# EAGLE schematic RF-STM32 v62 (EAGLE 9.7.0)
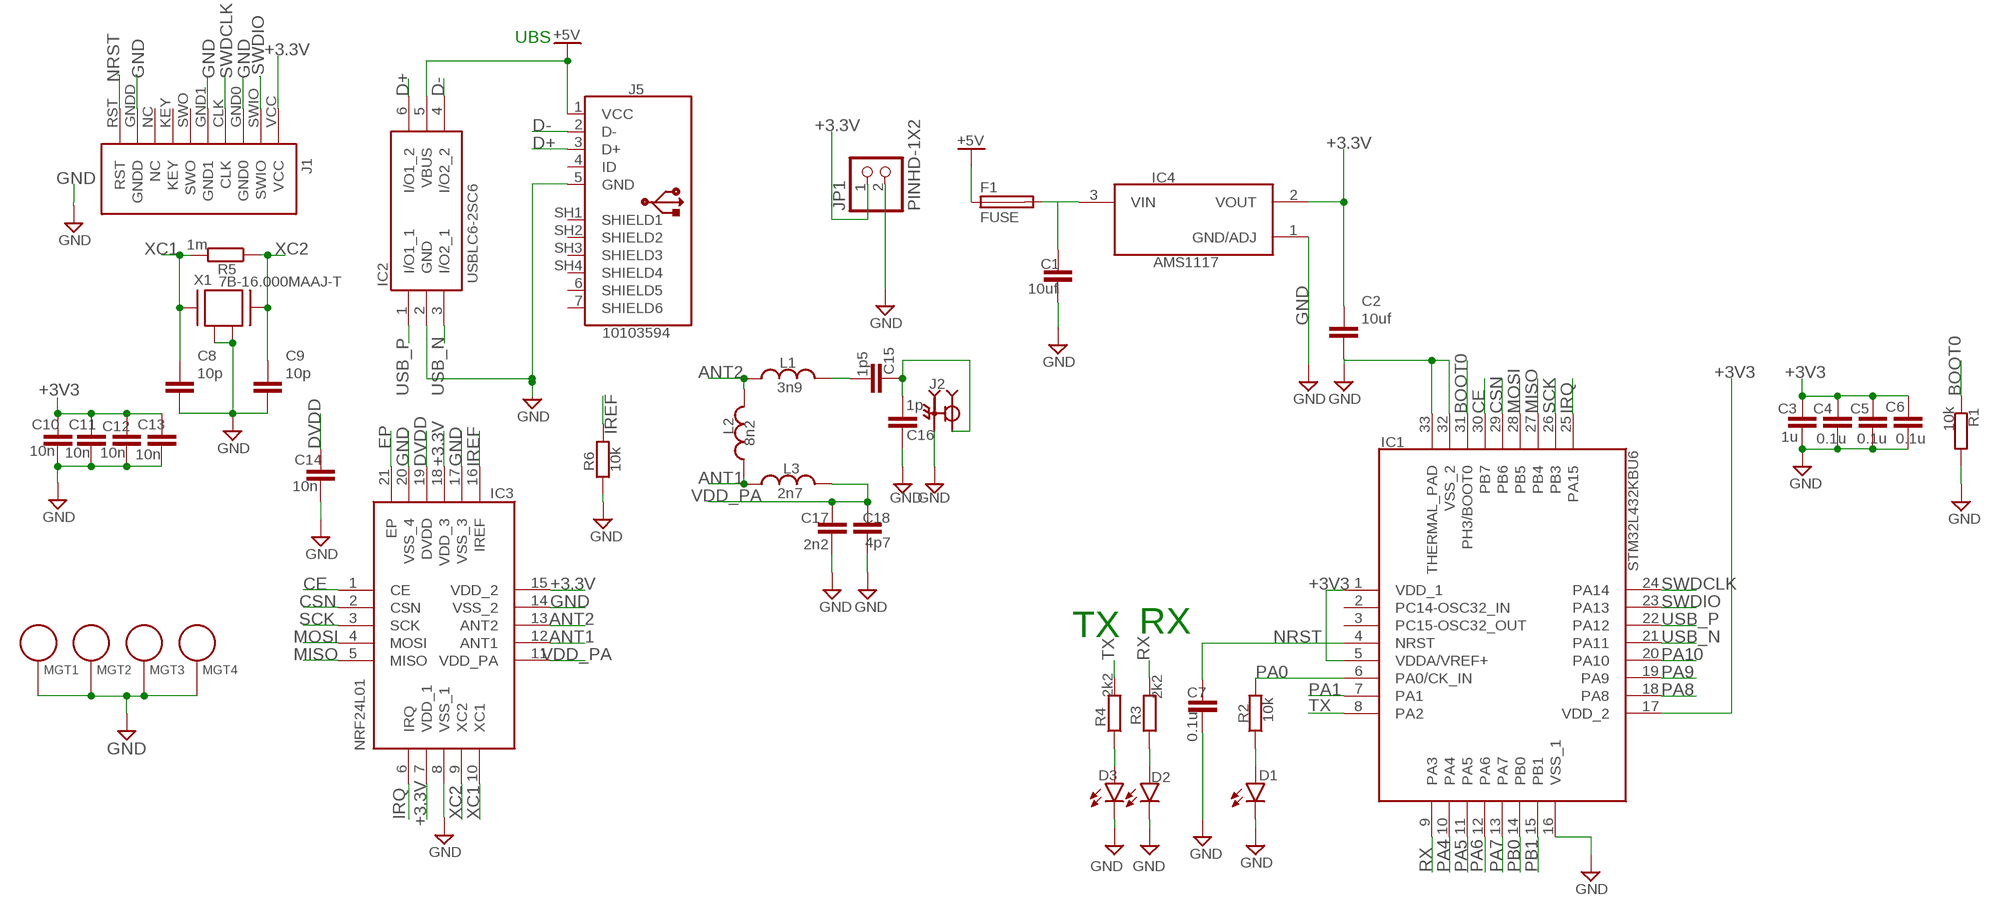
[diagram p0: schematic, sheet 1]

## Parts
C1  10uf  C_CHIP-0603(1608-METRIC)  [CAPC1608X85]
C2  10uf  C_CHIP-0603(1608-METRIC)  [CAPC1608X85]
C3  1u  C_CHIP-0603(1608-METRIC)  [CAPC1608X85]
C4  0.1u  C_CHIP-0603(1608-METRIC)  [CAPC1608X85]
C5  0.1u  C_CHIP-0603(1608-METRIC)  [CAPC1608X85]
C6  0.1u  C_CHIP-0603(1608-METRIC)  [CAPC1608X85]
C7  0.1u  C_CHIP-0603(1608-METRIC)  [CAPC1608X85]
C8  10p  C_CHIP-0603(1608-METRIC)  [CAPC1608X85]
C9  10p  C_CHIP-0603(1608-METRIC)  [CAPC1608X85]
C10  10n  C_CHIP-0603(1608-METRIC)  [CAPC1608X85]
C11  10n  C_CHIP-0603(1608-METRIC)  [CAPC1608X85]
C12  10n  C_CHIP-0603(1608-METRIC)  [CAPC1608X85]
C13  10n  C_CHIP-0603(1608-METRIC)  [CAPC1608X85]
C14  10n  C_CHIP-0603(1608-METRIC)  [CAPC1608X85]
C15  1p5  C_CHIP-0603(1608-METRIC)  [CAPC1608X85]
C16  1p  C_CHIP-0603(1608-METRIC)  [CAPC1608X85]
C17  2n2  C_CHIP-0603(1608-METRIC)  [CAPC1608X85]
C18  4p7  C_CHIP-0603(1608-METRIC)  [CAPC1608X85]
D1  CHIP-ROUND-R_0603-1MM  [LEDC1608X95N_RND-R]
D2  CHIP-ROUND-R_0603-1MM  [LEDC1608X95N_RND-R]
D3  CHIP-ROUND-R_0603-1MM  [LEDC1608X95N_RND-R]
F1  FUSE  FUSE_CHIP-0603(1608-METRIC)  [FUSC1608X60N]
IC1  STM32L432KBU6  [QFN50P500X500X60-33N]
IC2  USBLC6-2SC6  [SOT95P280X145-6N]
IC3  NRF24L01  [QFN50P400X400X95-21N]
IC4  AMS1117  [SOT229P700X180-4N]
J1  826953-5  [TE_826953-5]
J2  SMA-J-P-H-ST-EM1  [SAMTEC_SMA-J-P-H-ST-EM1]
J5  10103594  [10103594]
JP1  PINHD-1X2  [1X02]
L1  3n9  L_CHIP-0603(1608-METRIC)  [INDC1608X95N]
L2  8n2  L_CHIP-0603(1608-METRIC)  [INDC1608X95N]
L3  2n7  L_CHIP-0603(1608-METRIC)  [INDC1608X95N]
MGT1  MOUNTING_HOLE  [BEAGLEBONEBLACK_MOUNTING_HOLE]
MGT2  MOUNTING_HOLE  [BEAGLEBONEBLACK_MOUNTING_HOLE]
MGT3  MOUNTING_HOLE  [BEAGLEBONEBLACK_MOUNTING_HOLE]
MGT4  MOUNTING_HOLE  [BEAGLEBONEBLACK_MOUNTING_HOLE]
R1  10k  R_CHIP-0603(1608-METRIC)  [RESC1608X60]
R2  10k  R_CHIP-0603(1608-METRIC)  [RESC1608X60]
R3  2k2  R_CHIP-0603(1608-METRIC)  [RESC1608X60]
R4  2k2  R_CHIP-0603(1608-METRIC)  [RESC1608X60]
R5  1m  R_CHIP-0603(1608-METRIC)  [RESC1608X60]
R6  10k  R_CHIP-0603(1608-METRIC)  [RESC1608X60]
X1  7B-16.000MAAJ-T  [7B-16.000MAAJ-T]

## Nets
+3.3V: C2.1 IC3.7(VDD_1) IC3.15(VDD_2) IC3.18(VDD_3) IC4.2(VOUT) J1.VCC JP1.1
+3V3: C3.1 C4.1 C5.1 C6.1 C10.1 C11.1 C12.1 C13.1 IC1.1(VDD_1) IC1.5(VDDA/VREF+) IC1.17(VDD_2)
+5V: F1.1 IC2.5(VBUS) J5.1(VCC)
ANT1: IC3.12(ANT1) L2.1 L3.1
ANT2: IC3.13(ANT2) L1.1 L2.2
BOOT0: IC1.31(PH3/BOOT0) R1.2
CE: IC1.30(PB7) IC3.1(CE)
CSN: IC1.29(PB6) IC3.2(CSN)
D+: IC2.6(I/O1_2) J5.3(D+)
D-: IC2.4(I/O2_2) J5.2(D-)
DVDD: C14.1 IC3.19(DVDD)
EP: IC3.21(EP)
GND: C1.2 C2.2 C3.2 C4.2 C5.2 C6.2 C7.2 C8.2 C9.2 C10.2 C11.2 C12.2 C13.2 C14.2 C16.2 C17.1 C18.1 D1.C D2.C D3.C IC1.16(VSS_1) IC1.32(VSS_2) IC1.33(THERMAL_PAD) IC2.2(GND) IC3.8(VSS_1) IC3.14(VSS_2) IC3.17(VSS_3) IC3.20(VSS_4) IC4.1(GND/ADJ) J1.GND0 J1.GND1 J1.GNDD J2.2_1 J2.2_2 J2.3_1 J2.3_2 J5.5(GND) JP1.2 MGT1.P$1 MGT2.P$1 MGT3.P$1 MGT4.P$1 R1.1 R6.1 X1.2 X1.4
IREF: IC3.16(IREF) R6.2
IRQ: IC1.25(PA15) IC3.6(IRQ)
MISO: IC1.27(PB4) IC3.5(MISO)
MOSI: IC1.28(PB5) IC3.4(MOSI)
N$1: C1.1 F1.2 IC4.3(VIN)
N$3: D1.A R2.1
N$8: C15.1 L1.2
N$9: C15.2 C16.1 J2.1
N$11: D2.A R3.1
N$12: D3.A R4.1
NRST: C7.1 IC1.4(NRST) J1.RST
PA0: IC1.6(PA0/CK_IN) R2.2
PA1: IC1.7(PA1)
PA4: IC1.10(PA4)
PA5: IC1.11(PA5)
PA6: IC1.12(PA6)
PA7: IC1.13(PA7)
PA8: IC1.18(PA8)
PA9: IC1.19(PA9)
PA10: IC1.20(PA10)
PB0: IC1.14(PB0)
PB1: IC1.15(PB1)
RX: IC1.9(PA3) R3.2
SCK: IC1.26(PB3) IC3.3(SCK)
SWDCLK: IC1.24(PA14) J1.CLK
SWDIO: IC1.23(PA13) J1.SWIO
TX: IC1.8(PA2) R4.2
USB_N: IC1.21(PA11) IC2.3(I/O2_1)
USB_P: IC1.22(PA12) IC2.1(I/O1_1)
VDD_PA: C17.2 C18.2 IC3.11(VDD_PA) L3.2
XC1: C8.1 IC3.10(XC1) R5.2 X1.1
XC2: C9.1 IC3.9(XC2) R5.1 X1.3
Unconnected: IC1.2(PC14-OSC32_IN) IC1.3(PC15-OSC32_OUT) J1.KEY J1.NC J1.SWO J5.4(ID) J5.6(SHIELD5) J5.7(SHIELD6) J5.SH1(SHIELD1) J5.SH2(SHIELD2) J5.SH3(SHIELD3) J5.SH4(SHIELD4)

## Notes on the sheet
- UBS
- TX | RX

## Library data of the parts
C1-C18 = Capacitor:C: Capacitor - Generic; CATEGORY: Capacitor
D1-D3 = LED:CHIP-ROUND-R: LED - Generic; CATEGORY: LED; COLOR: RED; DESCRIPTION: CHIP LED ROUND; SUB-CATEGORY: CHIP; TYPE: ROUND_TOP
F1 = Circuit-Protection:FUSE: Fuse - Generic; CATEGORY: Circuit-Protection; SUB-CATEGORY: Fuse
IC1 = STM32L432KBU6/UFQFPN:STM32L432KBU6: ARM Microcontrollers - MCU Ultra-low-power with FPU ARM Cortex-M4 MCU 80 MHz with 256 Kbytes Flash, USB Source: Datasheet <http://www.st.com/content/ccc/resource/technical/document/datasheet/24/01/9f/59/f0/83/47/fc/DM00257205.pdf/files/DM00257205.pdf/jcr:content/translations/en.DM00257205.pdf>; ARROW_PART_NUMBER: STM32L432KBU6; ARROW_PRICE-STOCK: https://www.arrow.com/en/products/stm32l432kbu6/stmicroelectronics; DESCRIPTION: ARM Microcontrollers - MCU Ultra-low-power with FPU ARM Cortex-M4 MCU 80 MHz with 256 Kbytes Flash, USB; HEIGHT: 0.6mm; MANUFACTURER_NAME: STMicroelectronics; MANUFACTURER_PART_NUMBER: STM32L432KBU6; MOUSER_PART_NUMBER: 511-STM32L432KBU6; MOUSER_PRICE-STOCK: https://www.mouser.co.uk/ProductDetail/STMicroelectronics/STM32L432KBU6/?qs=qzCNEk%252BRr%252BbQvfxQ4ZNP4A%3D%3D
IC2 = USBLC6-2SC6:USBLC6-2SC6: TVS Diode Array Uni-Directional USBLC6-2SC6 17V, SOT-23 6-Pin Source: Datasheet <http://www.st.com/st-web-ui/static/active/en/resource/technical/document/datasheet/CD00050750.pdf>; ARROW_PART_NUMBER: USBLC6-2SC6; ARROW_PRICE-STOCK: https://www.arrow.com/en/products/usblc6-2sc6/stmicroelectronics; DESCRIPTION: TVS Diode Array Uni-Directional USBLC6-2SC6 17V, SOT-23 6-Pin; HEIGHT: 1.45mm; MANUFACTURER_NAME: STMicroelectronics; MANUFACTURER_PART_NUMBER: USBLC6-2SC6; MOUSER_PART_NUMBER: 511-USBLC6-2SC6; MOUSER_PRICE-STOCK: https://www.mouser.co.uk/ProductDetail/STMicroelectronics/USBLC6-2SC6?qs=po45yt2pPpu%2FhNIlwQdTlg%3D%3D
IC3 = NRF24L01-QFN-20pin:NRF24L01: RF Transceiver 1.9-3.6V 2.4GHz XCVR ENHNCD SHCKBRST Source: Datasheet <https://www.nordicsemi.com/chi/content/download/2730/34105/file/nRF24L01_Product_Specification_v2_0.pdf>; ARROW_PART_NUMBER: NRF24L01; ARROW_PRICE-STOCK: https://www.arrow.com/en/products/nrf24l01/nordic-semiconductor; DESCRIPTION: RF Transceiver 1.9-3.6V 2.4GHz XCVR ENHNCD SHCKBRST; HEIGHT: 0.95mm; MANUFACTURER_NAME: Nordic Semiconductor; MANUFACTURER_PART_NUMBER: NRF24L01; MOUSER_PART_NUMBER: 949-NRF24L01; MOUSER_PRICE-STOCK: https://www.mouser.co.uk/ProductDetail/Nordic-Semiconductor/nRF24L01?qs=yd0qOhnSiDdtPhpOyQGKeQ%3D%3D
IC4 = AMS1117:AMS1117: 1117 Source: Datasheet <https://datasheet.lcsc.com/szlcsc/Advanced-Monolithic-Systems-AMS-AMS1117-ADJ_C6188.pdf>; DESCRIPTION: 1117; HEIGHT: 1.8mm; MANUFACTURER_NAME: Advanced Monolithic Systems; MANUFACTURER_PART_NUMBER: AMS1117
J1 = Header-right-25pin-2.54mm:826953-5; COMMENT: 826953-5; EU_ROHS_COMPLIANCE: Compliant
J2 = SMA-J-P-H-ST-EM1:SMA-J-P-H-ST-EM1: SMA Connector Jack, Female Socket 50Ohm Board Edge, End Launch Solder; MANUFACTURER: Samtec; MAXIMUM_PACKAGE_HEIGHT: 3.675mm; PARTREV: G; STANDARD: Manufacturer Recommendations
J5 = Connector_USB:10103594: USB(2.0) Micro-B, RCPT, 5POS, SMD-THT-R/A Datasheet <https://cdn.amphenol-icc.com/media/wysiwyg/files/documentation/datasheet/inputoutput/io_usb_micro.pdf> Drawing <https://cdn.amphenol-icc.com/media/wysiwyg/files/drawing/10103594.pdf>; CATEGORY: Connectors; CONTACTS: 5; CURRENT-RATING: 1.8A; DESCRIPTION: CONN RCPT USB2.0 MICRO B SMD R/A; GENDER: Receptacle; MANUFACTURER: Amphenol ICC (FCI); MOUNT_TYPE: R/A; MPN: 10103594-0001LF; OPERATING_TEMPERATURE: -30°C ~ 80°C; PART_STATUS: ACTIVE; ROHS_COMPLIANT: COMPLIANT; SUB_CATEGORY: USB; TYPE: USB-micro B; VOLTAGE-RATING: 100VAC
JP1 = Connector:PINHD-1X2: PIN HEADER; CATEGORY: CONNECTOR; SUB-CATEGORY: PIN-HEADER
L1-L3 = Inductor:L: Inductor Fixed - Generic; CATEGORY: Inductor; SUB-CATEGORY: Fixed
MGT1-MGT4 = BeagleBone_Blue_R3:MOUNTING_HOLE: Chassis Mounting Hole w/GND connection ability
R1-R6 = Resistor:R: Resistor Fixed - Generic; CATEGORY: Resistor; SUB-CATEGORY: Fixed
X1 = Crystals_Oscillators:7B-16.000MAAJ-T: CRYSTAL 16.0000MHZ 18PF SMD Manufacturer's datasheet <http://www.txccorp.com/download/products/quartz_crystals/2015TXC_7B_19.pdf>; CRAETED_BY: PCBLayout.com; DIGIKEY_PART_NUMBER: 887-1104-2-ND; MANUFACTURER: TXC CORPORATION; MPN: 7B-16.000MAAJ-T; PACKAGE: SMD 4